# EAGLE design IoTKitV3th-ohneGND (EAGLE 9.2.0)
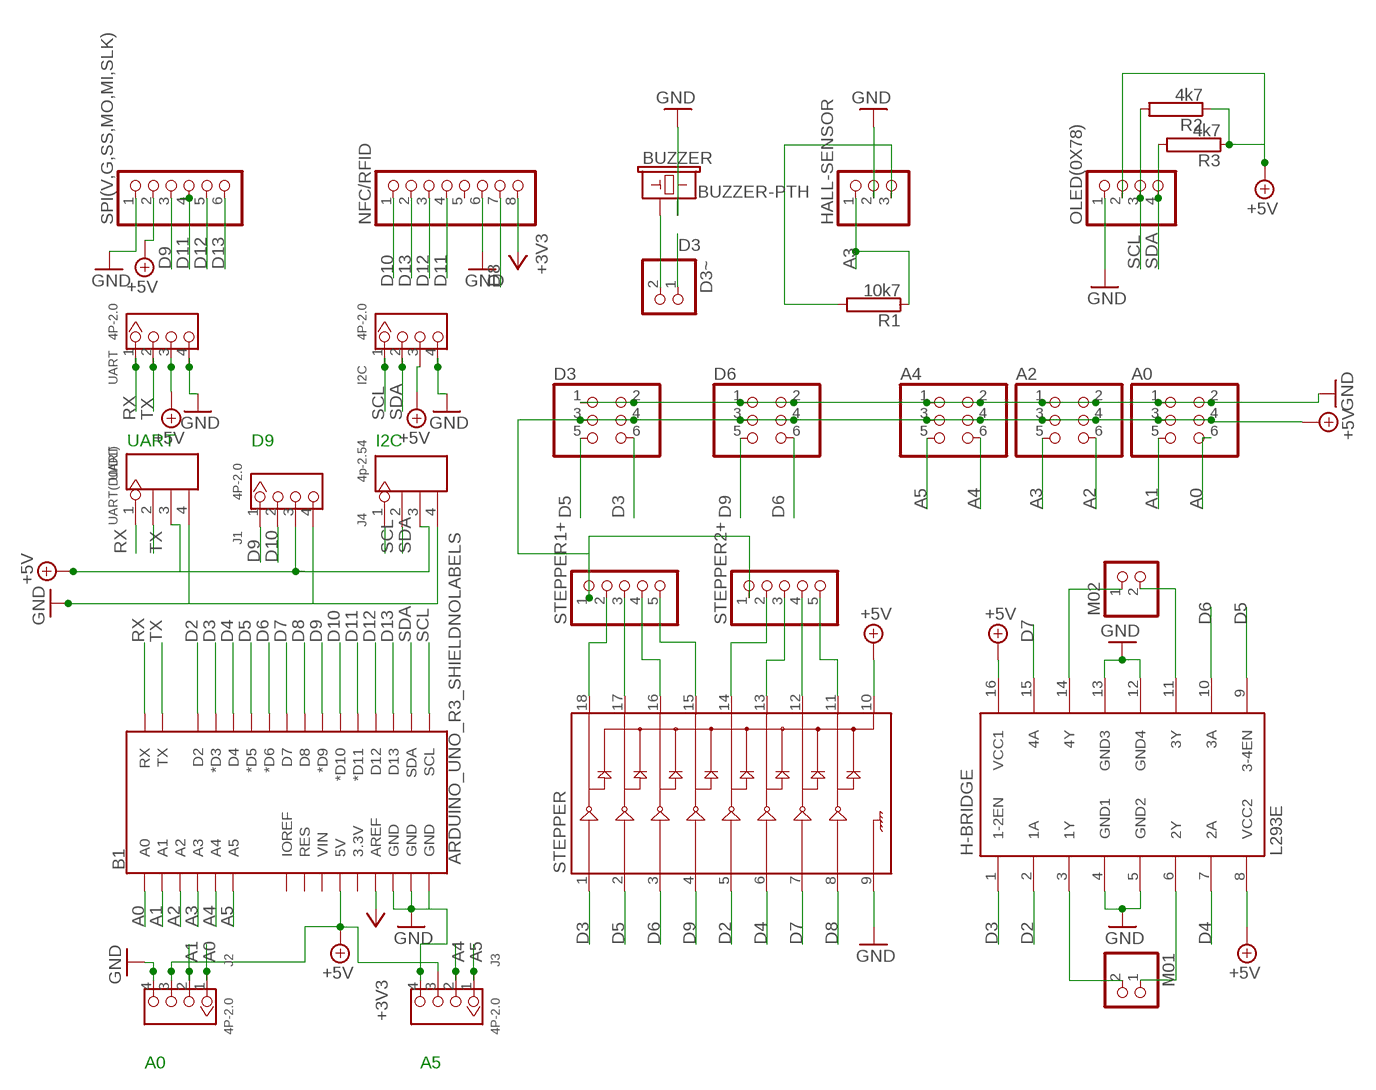
[diagram p0: schematic, sheet 1]

## Parts
A0  PINHD-2X3  [2X03]
A2  PINHD-2X3  [2X03]
A4  PINHD-2X3  [2X03]
B1  ARDUINO_UNO_R3_SHIELDNOLABELS  [UNO_R3_SHIELD_NOLABELS]
BUZZER  BUZZER-PTH  [BUZZER-12MM]
D3  PINHD-2X3  [2X03]
D3~  PINHD-1X2  [1X02]
D6  PINHD-2X3  [2X03]
H-BRIDGE  L293E  [DIL16]
HALL-SENSOR  PINHD-1X3  [1X03]
I2C  4P-2.0  GROVE-CONNECTOR-DIP(4P-2.0)  [HW4-2.0]
J1  4P-2.0  GROVE-CONNECTOR-DIP(4P-2.0)  [HW4-2.0]
J2  4P-2.0  GROVE-CONNECTOR-DIP(4P-2.0)  [HW4-2.0]
J3  4P-2.0  GROVE-CONNECTOR-DIP(4P-2.0)  [HW4-2.0]
J4  4p-2.54  DIP-BLACK-MALE-HEADER-VERT(4P-2.54)  [H4-2.54]
M01  PINHD-1X2  [1X02]
M02  PINHD-1X2  [1X02]
NFC/RFID  PINHD-1X8  [1X08]
OLED(0X78)  PINHD-1X4  [1X04]
R1  10k7  RCA0001  [CA0001]
R2  4k7  RCA0001  [CA0001]
R3  4k7  RCA0001  [CA0001]
SPI(V,G,SS,MO,MI,SLK)  PINHD-1X6  [1X06]
STEPPER  ULN2803DIP  [DIL18]
STEPPER1+  PINHD-1X5  [1X05]
STEPPER2+  PINHD-1X5  [1X05]
UART  4P-2.0  GROVE-CONNECTOR-DIP(4P-2.0)  [HW4-2.0]
UART(D0/D1)  UART  DIP-BLACK-MALE-HEADER-VERT(4P-2.54)  [H4-2.54]

## Nets
+3V3: B1.AREF NFC/RFID.8
+5V: A0.3 A0.4 A2.3 A2.4 A4.3 A4.4 B1.5V D3.3 D3.4 D6.3 D6.4 H-BRIDGE.8(VCC2) H-BRIDGE.16(VCC1) I2C.3 J1.3 J2.3 J3.3 J4.3 OLED(0X78).2 R2.1 R3.1 SPI(V,G,SS,MO,MI,SLK).2 STEPPER1+.1 STEPPER2+.1 STEPPER.10 UART(D0/D1).3 UART.3
A0: A0.6 B1.A0 J2.1
A1: A0.5 B1.A1 J2.2
A2: A2.6 B1.A2
A3: A2.5 B1.A3 HALL-SENSOR.1 R1.1
A4: A4.6 B1.A4 J3.2
A5: A4.5 B1.A5 J3.1
D2: B1.D2 H-BRIDGE.2(1A) STEPPER.5
D3: B1.D3(*D3) D3.6 D3~.1 H-BRIDGE.1(1-2EN) STEPPER.1
D4: B1.D4 H-BRIDGE.7(2A) STEPPER.6
D5: B1.D5(*D5) D3.5 H-BRIDGE.9(3-4EN) STEPPER.2
D6: B1.D6(*D6) D6.6 H-BRIDGE.10(3A) STEPPER.3
D7: B1.D7 H-BRIDGE.15(4A) STEPPER.7
D8: B1.D8 NFC/RFID.7 STEPPER.8
D9: B1.D9(*D9) D6.5 J1.1 SPI(V,G,SS,MO,MI,SLK).3 STEPPER.4
D10: B1.D10(*D10) J1.2 NFC/RFID.1
D11: B1.D11(*D11) NFC/RFID.4 SPI(V,G,SS,MO,MI,SLK).4
D12: B1.D12 NFC/RFID.3 SPI(V,G,SS,MO,MI,SLK).5
D13: B1.D13 NFC/RFID.2 SPI(V,G,SS,MO,MI,SLK).6
GND: A0.1 A0.2 A2.1 A2.2 A4.1 A4.2 B1.GND@0(GND) B1.GND@1(GND) B1.GND@2(GND) BUZZER.- D3.1 D3.2 D6.1 D6.2 H-BRIDGE.4(GND1) H-BRIDGE.5(GND2) H-BRIDGE.12(GND4) H-BRIDGE.13(GND3) HALL-SENSOR.2 I2C.4 J1.4 J2.4 J3.4 J4.4 NFC/RFID.6 OLED(0X78).1 SPI(V,G,SS,MO,MI,SLK).1 STEPPER.9 UART(D0/D1).4 UART.4
M01: H-BRIDGE.6(2Y) M01.1
N$1: STEPPER2+.2 STEPPER.14
N$2: STEPPER2+.3 STEPPER.13
N$3: STEPPER2+.4 STEPPER.12
N$4: STEPPER2+.5 STEPPER.11
N$5: BUZZER.+ D3~.2
N$13: HALL-SENSOR.3 R1.2
N$30: STEPPER1+.2 STEPPER.18
N$31: STEPPER1+.3 STEPPER.17
N$32: STEPPER1+.4 STEPPER.16
N$33: STEPPER1+.5 STEPPER.15
N$38: H-BRIDGE.14(4Y) M02.1
N$39: H-BRIDGE.11(3Y) M02.2
N$40: H-BRIDGE.3(1Y) M01.2
RX: B1.RX UART(D0/D1).1 UART.1
SCL: B1.SCL I2C.1 J4.1 OLED(0X78).3 R2.2
SDA: B1.SDA I2C.2 J4.2 OLED(0X78).4 R3.2
TX: B1.TX UART(D0/D1).2 UART.2
Unconnected: B1.3.3V B1.IOREF B1.RES B1.VIN NFC/RFID.5

## Notes on the sheet
- UART | D9 | I2C
- A0 | A5

## Library data of the parts
A0 A2 A4 D3 D6 = pinhead:PINHD-2X3: PIN HEADER
B1 = SparkFun-Boards:ARDUINO_UNO_R3_SHIELD: Arduino R3 Shield Footprint Shield form compatible with the Arduino Uno R3. SparkFun Products: MG2639 Cellular Shield <https://www.sparkfun.com/products/13120> MIDI Shield <https://www.sparkfun.com/products/12898> R3 Stackable Headers Kit <https://www.sparkfun.com/products/11417>
BUZZER = SparkFun-Electromechanical:BUZZER: Buzzer Small round buzzers that operate around the audible 2kHz range. You can use these as speakers to create simple music or user interfaces. Variant Overview: PTH - Mini Speaker - PC Mount 12mm 2.048kHz <https://www.sparkfun.com/products/7950> PTH_KIT - Mini Speaker - PC Mount 12mm 2.048kHz <https://www.sparkfun.com/products/7950> KIT simplifies soldering by adding stop mask to one side of the pads. PTH_NO_SILK - Mini Speaker - PC Mount 12mm 2.048kHz <https://www.sparkfun.com/products/7950> No silkscreen indicator of buzzer outline. PTH_KIT_NO_SILK - Mini Speaker - PC Mount 12mm 2.048kHz <https://www.sparkfun.com/products/7950> KIT package w/o silkscreen SMD - Buzzer Audio Magnetic (CCV-084B16) SMD buzzer used on, e.g. the LilyPad Buzzer <https://www.sparkfun.com/products/8463> and RFID USB Reader <https://www.sparkfun.com/products/9963>. SMD_KIT - Buzzer Audio Magnetic (CCV-084B16) SMD Buzzer with elongated pins to make soldering easier. Used on the SparkFun Simon Says - Surface Mount Soldering Kit <https://www.sparkfun.com/products/10935>.; PROD_ID: COMP-08253; SF_SKU: COM-07950
D3~ M01 M02 = pinhead:PINHD-1X2: PIN HEADER
H-BRIDGE = texas:L293E: TI DEVICE; MF: Arrow Electronics; MPN: L293E; OC_FARNELL: 1467711; OC_NEWARK: 89K0732
HALL-SENSOR = pinhead:PINHD-1X3: PIN HEADER
I2C J1-J3 UART = Seeed-Connector:GROVE-CONNECTOR-DIP(4P-2.0): 320110033
J4 = Seeed-Connector:DIP-BLACK-MALE-HEADER-VERT(4P-2.54): 320020017; MPN: P125-1104A0BS116A1
NFC/RFID = pinhead:PINHD-1X8: PIN HEADER
OLED(0X78) = pinhead:PINHD-1X4: PIN HEADER
R1-R3 = resistor-power:R: Power Resitor; OC_FARNELL: unknown; OC_NEWARK: unknown
SPI(V,G,SS,MO,MI,SLK) = pinhead:PINHD-1X6: PIN HEADER
STEPPER = SparkFun-IC-Special-Function:ULN2803: Darlington Driver(IC-07959, low stock) ULN2803 Darlington array. 500mA max per channel, 8-channel package. Spark Fun Electronics SKU : COM-00312
STEPPER1+ STEPPER2+ = pinhead:PINHD-1X5: PIN HEADER
UART(D0/D1) = Seeed-Connector:DIP-BLACK-MALE-HEADER-VERT(4P-2.54): 320020017; MPN: P125-1104A0BS116A1; VALUE: 4p-2.54

## Board
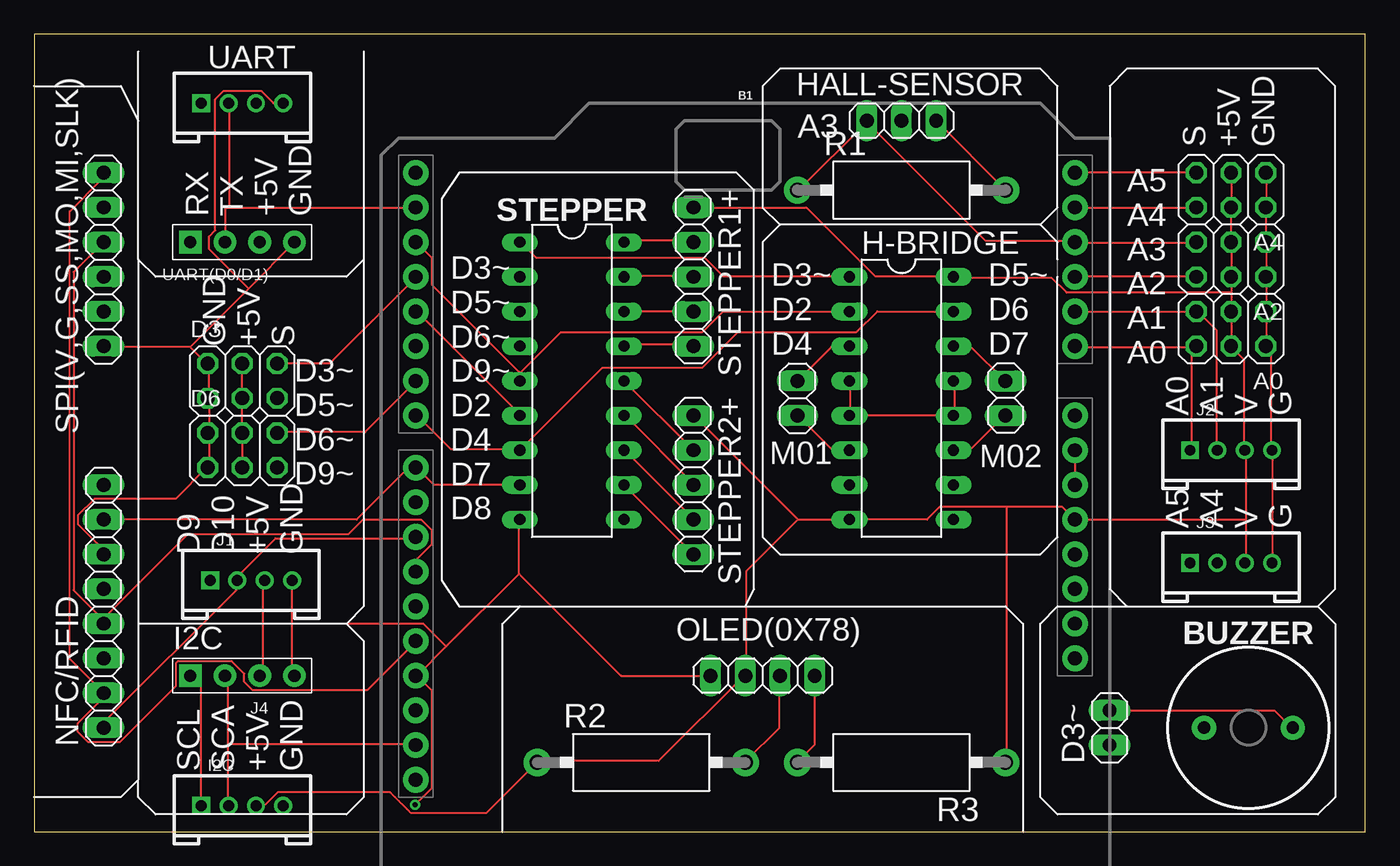
[diagram p1: board, top side]
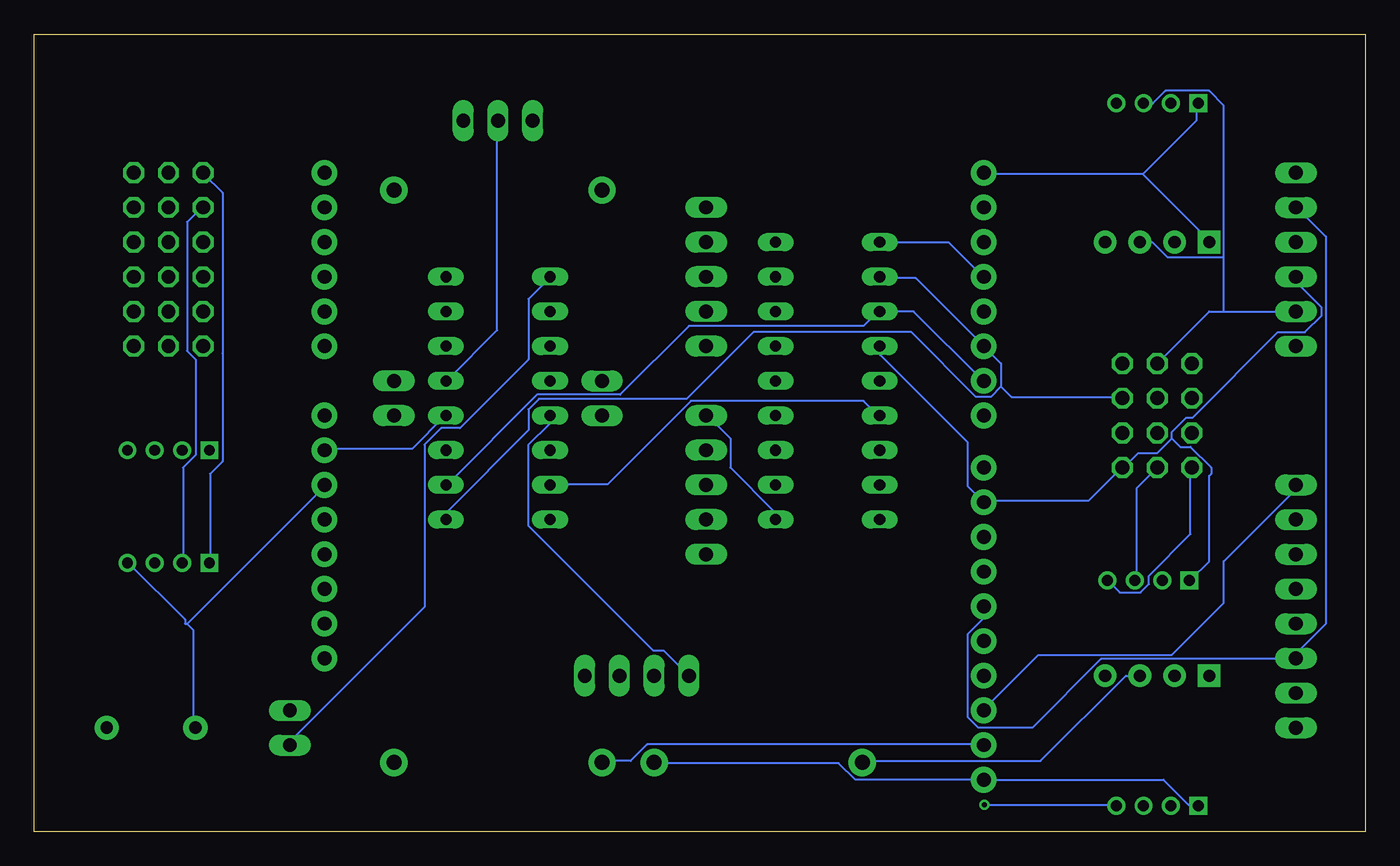
[diagram p2: board, bottom side, seen from below]

Size 97.46 x 58.41 mm. Coordinates in mm from the lower left corner, seen from the top.
Outline: 0,0 97.46,0 97.46,58.41 0,58.41 0,0
Copper layers (1*16): Top 0.035mm / dielectric 1.5mm / Bottom 0.035mm
Design rules "default": minimum track width 6mil, minimum drill 0.35mm, track to track 6mil, track to pad 6mil, pad to pad 6mil, via to via 6mil, smd to smd 6mil, copper to edge 40mil, drill to drill 6mil, minimum pad ring 10mil, minimum via ring 8mil, stop-mask expansion 4mil, vias tented up to drill 0mil, thermal gap 10mil

### Footprints (pad centres in the part's own frame; a part is rotated, then mirrored left to right if it is on the bottom)
2X03 = drill 1.016 octagon: 1 -2.54,-1.27; 2 -2.54,1.27; 3 0,-1.27; 4 0,1.27; 5 2.54,-1.27; 6 2.54,1.27
UNO_R3_SHIELD_NOLABELS = drill 1.016 pad 1.88: 3.3V 24.13,-3.81; 5V 24.13,-1.27; A0 24.13,11.43; A1 24.13,13.97; A2 24.13,16.51; A3 24.13,19.05; A4 24.13,21.59; A5 24.13,24.13; AREF -24.13,-15.24; D2 -24.13,19.05; D3 -24.13,16.51; D4 -24.13,13.97; D5 -24.13,11.43; D6 -24.13,8.89; D7 -24.13,6.35; D8 -24.13,2.54; D9 -24.13,0; D10 -24.13,-2.54; D11 -24.13,-5.08; D12 -24.13,-7.62; D13 -24.13,-10.16; GND@0 24.13,1.27; GND@1 24.13,3.81; GND@2 -24.13,-12.7; IOREF 24.13,-8.89; NC 24.13,-11.43; RES 24.13,-6.35; RX -24.13,24.13; SCL -24.13,-20.32; SDA -24.13,-17.78; TX -24.13,21.59; VIN 24.13,6.35
BUZZER-12MM = drill 0.9 pad 1.778: + 3.25,0; - -3.25,0
1X02 = drill 1.016 long: 1 -1.27,0; 2 1.27,0
DIL16 = drill 0.813 long: 1 -8.89,-3.81; 2 -6.35,-3.81; 3 -3.81,-3.81; 4 -1.27,-3.81; 5 1.27,-3.81; 6 3.81,-3.81; 7 6.35,-3.81; 8 8.89,-3.81; 9 8.89,3.81; 10 6.35,3.81; 11 3.81,3.81; 12 1.27,3.81; 13 -1.27,3.81; 14 -3.81,3.81; 15 -6.35,3.81; 16 -8.89,3.81
1X03 = drill 1.016 long: 1 -2.54,0; 2 0,0; 3 2.54,0
HW4-2.0 = drill 0.8 pad 1.27 square: 1 -3,0 | drill 0.8 pad 1.27: 2 -1,0; 3 1,0; 4 3,0
H4-2.54 = drill 0.889 pad 1.651 square: 1 0,3.81 | drill 0.889 pad 1.651: 2 0,1.27; 3 0,-1.27; 4 0,-3.81
1X08 = drill 1.016 long: 1 -8.89,0; 2 -6.35,0; 3 -3.81,0; 4 -1.27,0; 5 1.27,0; 6 3.81,0; 7 6.35,0; 8 8.89,0
1X04 = drill 1.016 long: 1 -3.81,0; 2 -1.27,0; 3 1.27,0; 4 3.81,0
CA0001 = drill 1.1 pad 2: 1 -7.62,0; 2 7.62,0
1X06 = drill 1.016 long: 1 -6.35,0; 2 -3.81,0; 3 -1.27,0; 4 1.27,0; 5 3.81,0; 6 6.35,0
DIL18 = drill 0.813 long: 1 -10.16,-3.81; 2 -7.62,-3.81; 3 -5.08,-3.81; 4 -2.54,-3.81; 5 0,-3.81; 6 2.54,-3.81; 7 5.08,-3.81; 8 7.62,-3.81; 9 10.16,-3.81; 10 10.16,3.81; 11 7.62,3.81; 12 5.08,3.81; 13 2.54,3.81; 14 0,3.81; 15 -2.54,3.81; 16 -5.08,3.81; 17 -7.62,3.81; 18 -10.16,3.81
1X05 = drill 1.016 long: 1 -5.08,0; 2 -2.54,0; 3 0,0; 4 2.54,0; 5 5.08,0

### Placement (x,y rotation side)
A0  87.63,36.83 180 top
A2  87.63,41.91 180 top
A4  87.63,46.99 180 top
B1  52.07,24.13 0 top
BUZZER  88.9,7.62 0 top
D3  15.24,33.02 0 top
D3~  78.74,7.62 90 top
D6  15.24,27.94 0 top
H-BRIDGE  63.5,31.75 270 top
HALL-SENSOR  63.5,52.07 0 top
I2C  15.24,1.91 0 top
J1  15.88,18.41 0 top
J2  87.63,27.94 0 top
J3  87.63,19.68 0 top
J4  15.24,11.43 90 top
M01  55.88,31.75 90 top
M02  71.12,31.75 270 top
NFC/RFID  5.08,16.51 90 top
OLED(0X78)  53.34,11.43 0 top
R1  63.5,46.99 0 top
R2  44.45,5.08 0 top
R3  63.5,5.08 180 top
SPI(V,G,SS,MO,MI,SLK)  5.08,41.91 90 top
STEPPER  39.37,33.02 270 top
STEPPER1+  48.26,40.64 270 top
STEPPER2+  48.26,25.4 270 top
UART  15.24,53.34 0 top
UART(D0/D1)  15.24,43.18 90 top

### Tracks (layer width: path | path; a pad name or v marks a point on that pad's centre or on a via)
+3V3
  Bottom 0.152: NFC/RFID.8 5.18,25.3 5.18,24.99 10.36,19.81 10.36,16.76 14.17,12.95 23.93,12.95 27.89,8.99 B1.AREF
+5V
  Top 0.152: D6.3 D6.4 D3.3 D3.4 | 55.93,22.86 H-BRIDGE.8 65.38,22.86 66.29,23.77 71.17,23.77 | 55.93,22.86 48.31,30.48 STEPPER2+.1 | 55.93,22.86 52.12,19.05 52.12,11.43 OLED(0X78).2 51.97,11.43 45.72,5.18 36.88,5.18 R2.1 36.73,5.03 33.07,1.37 27.58,1.37 26.06,2.9 17.83,2.9 16.92,1.98 16.31,1.98 I2C.3 | STEPPER1+.1 56.54,45.72 61.57,40.69 67.21,40.69 H-BRIDGE.16 67.36,40.54 74.52,40.54 75.59,39.47 87.63,39.47 | A4.3 A4.4 A2.3 A2.4 87.63,39.47 | 87.63,39.47 A0.3 A0.4 87.63,35.51 88.54,34.59 88.54,28.04 J2.3 88.7,27.89 88.7,22.86 | 71.17,5.94 71.17,5.18 R3.1 71.17,5.94 | 71.17,23.77 75.29,23.77 B1.5V 88.7,22.86 | J1.3 16.76,18.29 16.76,11.58 16.61,11.43 J4.3 | 88.7,22.86 88.7,19.81 J3.3 | 71.17,23.77 71.17,5.94
  Bottom 0.152: 10.36,38.1 11.43,38.1 D3.4 | 10.36,38.1 SPI(V,G,SS,MO,MI,SLK).2 | 10.36,38.1 10.36,42.06 | 10.36,42.06 14.48,42.06 15.54,43.13 16.46,43.13 UART(D0/D1).3 | STEPPER.10 43.28,22.86 43.28,23.47 46.48,26.67 46.48,28.8 48.16,30.48 STEPPER2+.1 | UART.3 15.54,53.34 14.63,54.25 11.43,54.25 10.36,53.19 10.36,42.06 | D6.3 16.76,25.15 16.76,18.44 J1.3 | J4.3 16.61,11.43 17.53,11.43 23.77,5.18 36.73,5.18 R2.1
A0
  Top 0.152: 84.73,35.51 76.2,35.51 B1.A0 | 84.73,35.51 85.04,35.51 A0.6 84.73,35.51 | 84.73,35.51 84.73,28.04 J2.1
A1
  Top 0.152: B1.A1 A0.5 85.19,38.1 86.56,36.73 86.56,28.04 J2.2
A2
  Top 0.152: A2.6 85.04,40.69 76.2,40.69 B1.A2
A3
  Top 0.152: A2.5 85.04,43.13 76.2,43.13 B1.A3 76.2,43.28 69.65,43.28 60.96,51.97 | 60.96,51.97 55.93,46.94 R1.1 | 60.96,51.97 HALL-SENSOR.1
A4
  Top 0.152: B1.A4 A4.6
  Bottom 0.152: A4.6 85.19,45.72 86.26,44.65 86.26,35.2 85.65,34.59 85.65,27.58 86.56,26.67 86.56,19.81 J3.2
A5
  Top 0.152: A4.5 85.04,48.31 76.2,48.31 B1.A5
  Bottom 0.152: A4.5 85.04,48.16 83.67,46.79 83.67,35.05 83.67,27.13 84.58,26.21 84.58,19.81 J3.1
D2
  Top 0.152: 35.51,33.53 35.51,33.68 29.11,40.08 29.11,42.06 28.04,43.13 B1.D2 | 35.51,33.53 35.51,33.07 STEPPER.5 35.51,33.53 | H-BRIDGE.2 50.44,38.1 48.92,36.58 38.56,36.58 35.51,33.53
D3
  Top 0.152: H-BRIDGE.1 59.59,40.69 50.44,40.69 49.07,42.06 36.73,42.06 35.66,43.13 STEPPER.1 | D3.6 21.64,34.29 27.89,40.54 B1.D3
  Bottom 0.152: STEPPER.1 35.51,43.13 30.48,43.13 28.04,40.69 B1.D3 | D3~.1 78.64,6.4 78.64,6.71 68.89,16.46 68.89,28.35 67.67,29.57 66.29,29.57 61.27,34.59 61.27,39.01 59.74,40.54 H-BRIDGE.1
D4
  Top 0.152: B1.D4 28.04,38.1 35.66,30.48 STEPPER.6
  Bottom 0.152: H-BRIDGE.7 59.59,25.45 55.47,25.45 49.38,31.55 36.73,31.55 35.66,30.48 STEPPER.6
D5
  Bottom 0.152: STEPPER.2 35.51,40.54 32.92,40.54 B1.D5 26.67,34.29 26.67,32.61 | 26.67,32.61 27.43,31.85 28.5,31.85 33.22,36.58 44.81,36.58 49.68,31.7 60.5,31.7 61.27,30.94 61.27,29.41 67.21,23.47 67.21,22.86 H-BRIDGE.9 | 26.67,32.61 25.91,31.85 17.83,31.85 D3.5
D6
  Top 0.152: D6.6 17.83,29.26 24.23,29.26 27.89,32.92 B1.D6
  Bottom 0.152: B1.D6 28.04,33.07 33.07,38.1 STEPPER.3 35.66,38.1 36.73,37.03 49.53,37.03 54.56,32 60.66,32 67.21,25.45 H-BRIDGE.10
D7
  Top 0.152: B1.D7 28.04,30.48 30.48,28.04 35.51,28.04 STEPPER.7 41.6,33.98 48.92,33.98 51.51,36.58 60.2,36.58 61.72,38.1 H-BRIDGE.15
D8
  Top 0.152: STEPPER.8 35.51,25.45 29.26,25.45 28.04,26.67 B1.D8 27.43,26.67 23.62,22.86 NFC/RFID.7
D9
  Bottom 0.152: STEPPER.4 35.51,35.51 35.51,34.9 29.11,28.5 29.11,25.3 B1.D9 27.89,24.23 20.27,24.23 17.83,26.67 D6.5 17.68,26.67 16.61,27.74 15.24,27.74 14.17,28.8 | 14.17,28.8 14.17,29.26 13.11,30.33 12.65,30.33 6.4,36.58 4.42,36.58 3.2,37.8 3.2,38.41 5.03,40.23 5.03,40.54 SPI(V,G,SS,MO,MI,SLK).3 | 14.17,28.8 13.56,28.19 12.8,28.19 11.28,26.67 11.28,26.21 11.43,26.06 11.43,19.81 12.8,18.44 J1.1
D10
  Top 0.152: 5.18,8.08 5.18,7.62 NFC/RFID.1 5.18,8.08 | B1.D10 27.89,21.49 17.68,21.49 14.94,18.75 14.94,18.44 J1.2 14.78,18.29 14.78,17.68 5.18,8.08
D11
  Top 0.152: 5.03,15.54 5.03,15.24 NFC/RFID.4 5.03,15.54 | 5.03,15.54 2.9,17.68 2.9,41 SPI(V,G,SS,MO,MI,SLK).4 | 5.03,15.54 11.28,21.79 23.01,21.79 24.08,22.86 28.35,22.86 29.11,22.1 29.11,21.03 28.04,19.96 28.04,19.05 B1.D11
D12
  Bottom 0.152: SPI(V,G,SS,MO,MI,SLK).5 5.03,45.72 2.9,43.59 2.9,15.24 5.03,13.11 5.03,12.8 NFC/RFID.3 5.18,12.65 19.36,12.65 24.38,7.62 28.35,7.62 29.11,8.38 29.11,14.48 28.04,15.54 28.04,16.46 B1.D12
D13
  Top 0.152: B1.D13 27.89,13.87 24.38,10.36 16,10.36 15.39,10.97 15.39,11.58 14.48,12.5 10.52,12.5 10.36,12.34 10.36,10.67 6.25,6.55 3.96,6.55 3.2,7.32 3.2,7.92 5.03,9.75 5.03,10.06 NFC/RFID.2 2.59,12.65 2.59,45.41 5.03,47.85 5.03,48.16 SPI(V,G,SS,MO,MI,SLK).6
GND  (via drill 0.35)
  Top 0.152: B1.GND@1 B1.GND@0 | 59.74,30.48 59.74,32.92 H-BRIDGE.4 | H-BRIDGE.13 67.36,32.92 67.36,30.48 H-BRIDGE.12 59.74,30.48 | 59.74,30.48 H-BRIDGE.5 | 90.22,45.72 90.22,48.16 A4.1 | 90.22,38.1 90.22,35.66 A0.2 90.22,35.51 90.53,35.2 90.53,28.04 J2.4 90.68,27.89 90.68,19.81 J3.4 | 90.22,38.1 90.22,40.54 A2.2 90.22,40.69 90.22,43.13 A2.1 90.22,43.28 90.22,45.72 | 90.22,38.1 A0.1 | 90.22,45.72 A4.2 | 35.51,18.9 35.51,22.86 STEPPER.9 | 28.04,11.43 30.18,13.56 | 30.18,13.56 35.51,18.9 | OLED(0X78).1 42.98,11.43 35.51,18.9 | NFC/RFID.6 5.03,20.42 5.03,20.73 3.2,22.55 3.2,23.16 4.42,24.38 10.36,24.38 12.65,26.67 D6.1 12.8,26.67 12.8,29.11 D6.2 12.8,29.26 12.8,31.7 D3.1 12.8,31.85 12.8,34.29 D3.2 12.65,34.29 11.43,35.51 | 11.43,35.51 5.18,35.51 SPI(V,G,SS,MO,MI,SLK).1 | 11.43,35.51 15.7,39.78 | 15.7,39.78 19.05,43.13 UART(D0/D1).4 | UART.4 17.53,53.34 16.61,54.25 13.87,54.25 13.26,53.65 13.26,44.04 12.8,43.59 12.8,42.67 15.7,39.78 | 18.9,15.24 18.9,11.58 J4.4 | 18.9,15.24 18.9,18.29 J1.4 | v27.89,1.98 29.11,3.2 29.11,10.36 28.04,11.43 | 28.04,11.43 B1.GND@2 | 18.9,15.24 28.5,15.24 30.18,13.56
  Bottom 0.152: HALL-SENSOR.2 63.55,51.97 63.55,36.73 67.21,33.07 H-BRIDGE.13 | B1.GND@1 76.2,28.04 69.8,28.04 67.36,30.48 H-BRIDGE.12 | 86.26,15.24 86.41,15.24 86.41,15.54 90.53,19.66 J3.4 | OLED(0X78).1 51.36,13.26 52.12,13.26 61.27,22.4 61.27,28.35 59.74,29.87 59.74,30.48 H-BRIDGE.5 | 86.26,15.24 85.8,14.78 85.8,7.62 BUZZER.- | v27.89,1.98 18.29,1.98 I2C.4 | D6.1 12.8,26.67 12.8,21.79 15.85,18.75 15.85,18.14 16.46,17.53 17.98,17.53 18.75,18.29 J1.4 | 86.26,15.24 76.2,25.3 B1.GND@0
M01
  Top 0.152: H-BRIDGE.6 59.59,28.04 58.37,28.04 55.93,30.48 M01.1
N$1
  Top 0.152: STEPPER2+.2 STEPPER.14
N$2
  Top 0.152: STEPPER.13 43.28,30.48 48.31,25.45 STEPPER2+.3
N$3
  Top 0.152: STEPPER.12 43.28,27.89 48.31,22.86 STEPPER2+.4
N$4
  Top 0.152: STEPPER2+.5 STEPPER.11
N$5
  Top 0.152: D3~.2 78.79,8.84 90.83,8.84 92.05,7.62 BUZZER.+
N$13
  Top 0.152: R1.2 HALL-SENSOR.3
N$30
  Top 0.152: STEPPER.18 43.28,43.28 48.16,43.28 STEPPER1+.2
N$31
  Top 0.152: STEPPER.17 43.28,40.69 48.16,40.69 STEPPER1+.3
N$32
  Top 0.152: STEPPER1+.4 STEPPER.16
N$33
  Top 0.152: STEPPER.15 43.28,35.66 48.16,35.66 STEPPER1+.5
N$38
  Top 0.152: H-BRIDGE.14 67.36,35.51 68.58,35.51 71.02,33.07 M02.1
N$39
  Top 0.152: H-BRIDGE.11 67.36,28.04 68.58,28.04 71.02,30.48 M02.2
N$40
  Top 0.152: M01.2 58.37,35.51 59.59,35.51 H-BRIDGE.3
RX
  Bottom 0.152: 16.31,48.16 27.89,48.16 B1.RX | 16.31,48.16 11.43,43.28 UART(D0/D1).1 | 16.31,48.16 12.34,52.12 12.34,53.34 UART.1
SCL
  Top 0.152: OLED(0X78).3 54.56,11.43 54.56,7.62 52.12,5.18 R2.2 | J4.1 12.19,10.67 12.19,1.98 I2C.1
  Bottom 0.152: R2.2 51.97,5.03 38.56,5.03 37.34,3.81 B1.SCL 14.78,3.81 12.95,1.98 12.34,1.98 I2C.1
SDA
  Top 0.152: OLED(0X78).4 57.15,6.4 55.93,5.18 R3.2 | 14.17,6.4 14.17,11.28 14.02,11.43 J4.2 | 14.17,6.4 14.17,1.98 I2C.2 | 14.17,6.4 27.89,6.4 B1.SDA
  Bottom 0.152: R3.2 55.78,5.18 53.8,5.18 52.58,6.4 28.04,6.4 B1.SDA
TX
  Top 0.152: UART(D0/D1).2 14.02,43.28 14.02,45.72 14.33,45.72 | 14.33,45.72 B1.TX | 14.33,45.72 14.33,53.34 UART.2

### Text on the board
tNames: A3 | S / +5V / GND | RX / TX / +5V / GND | GND / +5V / S | D3~ / D2 / D4 | D5~ / D6 / D7 | A5 / A4 / A3 / A2 / A1 / A0 | A0 / A1 / V / G | D3~ / D5~ / D6~ / D9~ | D3~ / D5~ / D6~ / D9~ / D2 / D4 / D7 / D8 | A5 / A4 / V / G | D9 / D10 / +5V / GND | I2C | SCL / SCA / +5V / GND